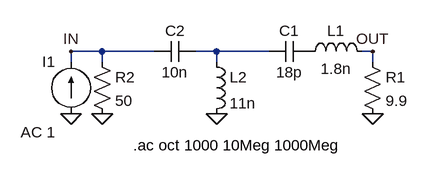
[diagram p0: schematic ltc5566_matching_374MHz.asc]
ltc5566_matching_374MHz.asc, the LTspice schematic file:
Version 4
SHEET 1 880 680
WIRE -128 112 -176 112
WIRE -48 112 -128 112
WIRE 48 112 16 112
WIRE 128 112 48 112
WIRE 288 112 272 112
WIRE -176 128 -176 112
WIRE -128 128 -128 112
WIRE 48 128 48 112
WIRE 288 128 288 112
FLAG 288 208 0
FLAG -176 208 0
FLAG -128 208 0
FLAG -176 112 IN
FLAG 288 112 OUT
FLAG 48 208 0
SYMBOL ind 176 128 R270
WINDOW 0 32 56 VTop 2
WINDOW 3 5 56 VBottom 2
SYMATTR InstName L1
SYMATTR Value 1.8n
SYMBOL res 272 112 R0
SYMATTR InstName R1
SYMATTR Value 9.9
SYMBOL cap 192 96 R90
WINDOW 0 0 32 VBottom 2
WINDOW 3 32 32 VTop 2
SYMATTR InstName C1
SYMATTR Value 18p
SYMBOL res -144 112 R0
SYMATTR InstName R2
SYMATTR Value 50
SYMBOL current -176 208 R180
WINDOW 0 24 80 Left 2
WINDOW 3 24 0 Left 2
WINDOW 123 24 -28 Left 2
WINDOW 39 0 0 Left 0
SYMATTR InstName I1
SYMATTR Value ""
SYMATTR Value2 AC 1
SYMBOL ind 32 112 R0
SYMATTR InstName L2
SYMATTR Value 11n
SYMBOL cap 16 96 R90
WINDOW 0 0 32 VBottom 2
WINDOW 3 32 32 VTop 2
SYMATTR InstName C2
SYMATTR Value 10n
TEXT -80 256 Left 2 !.ac oct 1000 10Meg 1000Meg

The netlist it stands for:
* ltc5566_matching_374MHz.asc
L1 P001 OUT 1.8n
R1 OUT 0 9.9
C1 P001 N001 18p
R2 IN 0 50
I1 0 IN AC 1
L2 N001 0 11n
C2 N001 IN 10n
.ac oct 1000 10Meg 1000Meg
.backanno
.end